# EAGLE design UARTBreakout-3.0 (EAGLE 9.6.2)
Assembly variants: JLCPCB

## Sheet 1 of 2
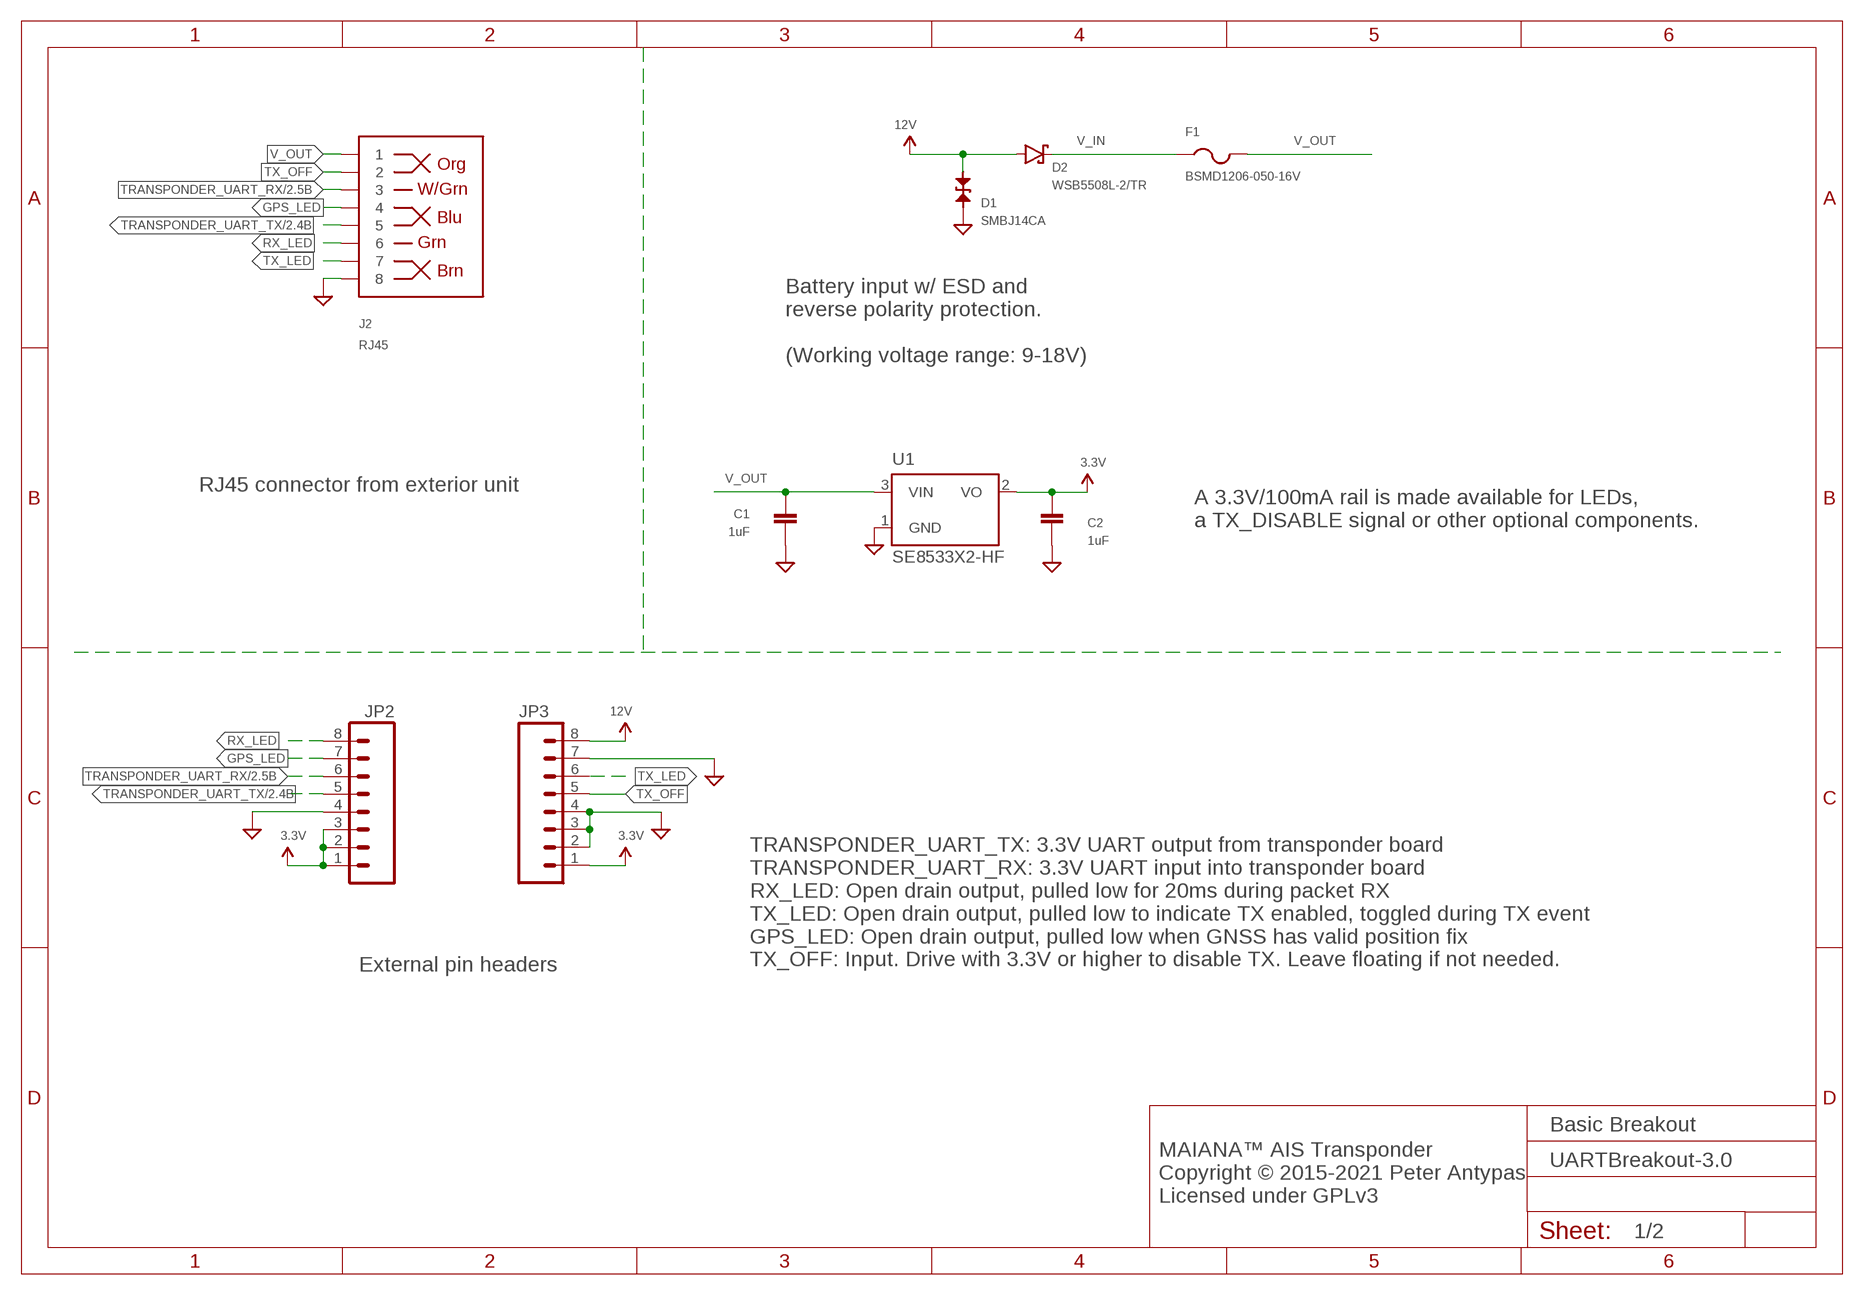
[diagram p0: schematic, sheet 1]

### Parts
C1  1uF  CAPACITOR0603  [0603]
C2  1uF  CAPACITOR0603  [0603]
D1  SMBJ14CA  DIODE-TVS-BIDIRSMB  [SMB-BIDIR]
D2  WSB5508L-2/TR  DIODE-SCHOTTKYSOD123  [SOD123]
F1  BSMD1206-050-16V  PTCFUSE-1206  [R1206]
J2  RJ45  RJ45-8PTH  [RJ45-8]
JP2  M08SILK_FEMALE_PTH  [1X08]
JP3  M08SILK_FEMALE_PTH  [1X08]
U1  SE8533X2-HF  MCP1799T  [SOT23]

### Nets
3.3V: C2.P$1 JP2.1 JP2.2 JP2.3 JP3.1 U1.2(VO)
12V: D1.A D2.A JP3.8
GND: C1.P$2 C2.P$2 D1.C J2.8 JP2.4 JP3.2 JP3.3 JP3.4 JP3.7 U1.1(GND) ; also sheet 2
GPS_LED: J2.4 JP2.7
RX_LED: J2.6 JP2.8
TRANSPONDER_UART_RX: J2.3 JP2.6 ; also sheet 2
TRANSPONDER_UART_TX: J2.5 JP2.5 ; also sheet 2
TX_LED: J2.7 JP3.6
TX_OFF: J2.2 JP3.5
V_IN: D2.C F1.1
V_OUT: C1.P$1 F1.2 J2.1 U1.3(VIN)

### Notes on the sheet
- Battery input w/ ESD and 
  reverse polarity protection.
  
  (Working voltage range: 9-18V)
- RJ45 connector from exterior unit
- A 3.3V/100mA rail is made available for LEDs,
  a TX_DISABLE signal or other optional components.
- External pin headers
- TRANSPONDER_UART_TX: 3.3V UART output from transponder board
  TRANSPONDER_UART_RX: 3.3V UART input into transponder board
  RX_LED: Open drain output, pulled low for 20ms during packet RX
  TX_LED: Open drain output, pulled low to indicate TX enabled, toggled during TX event
  GPS_LED: Open drain output, pulled low when GNSS has valid position fix
  TX_OFF: Input. Drive with 3.3V or higher to disable TX. Leave floating if not needed.
- Basic Breakout
- MAIANA™ AIS Transponder
  Copyright © 2015-2021 Peter Antypas
  Licensed under GPLv3

## Sheet 2 of 2
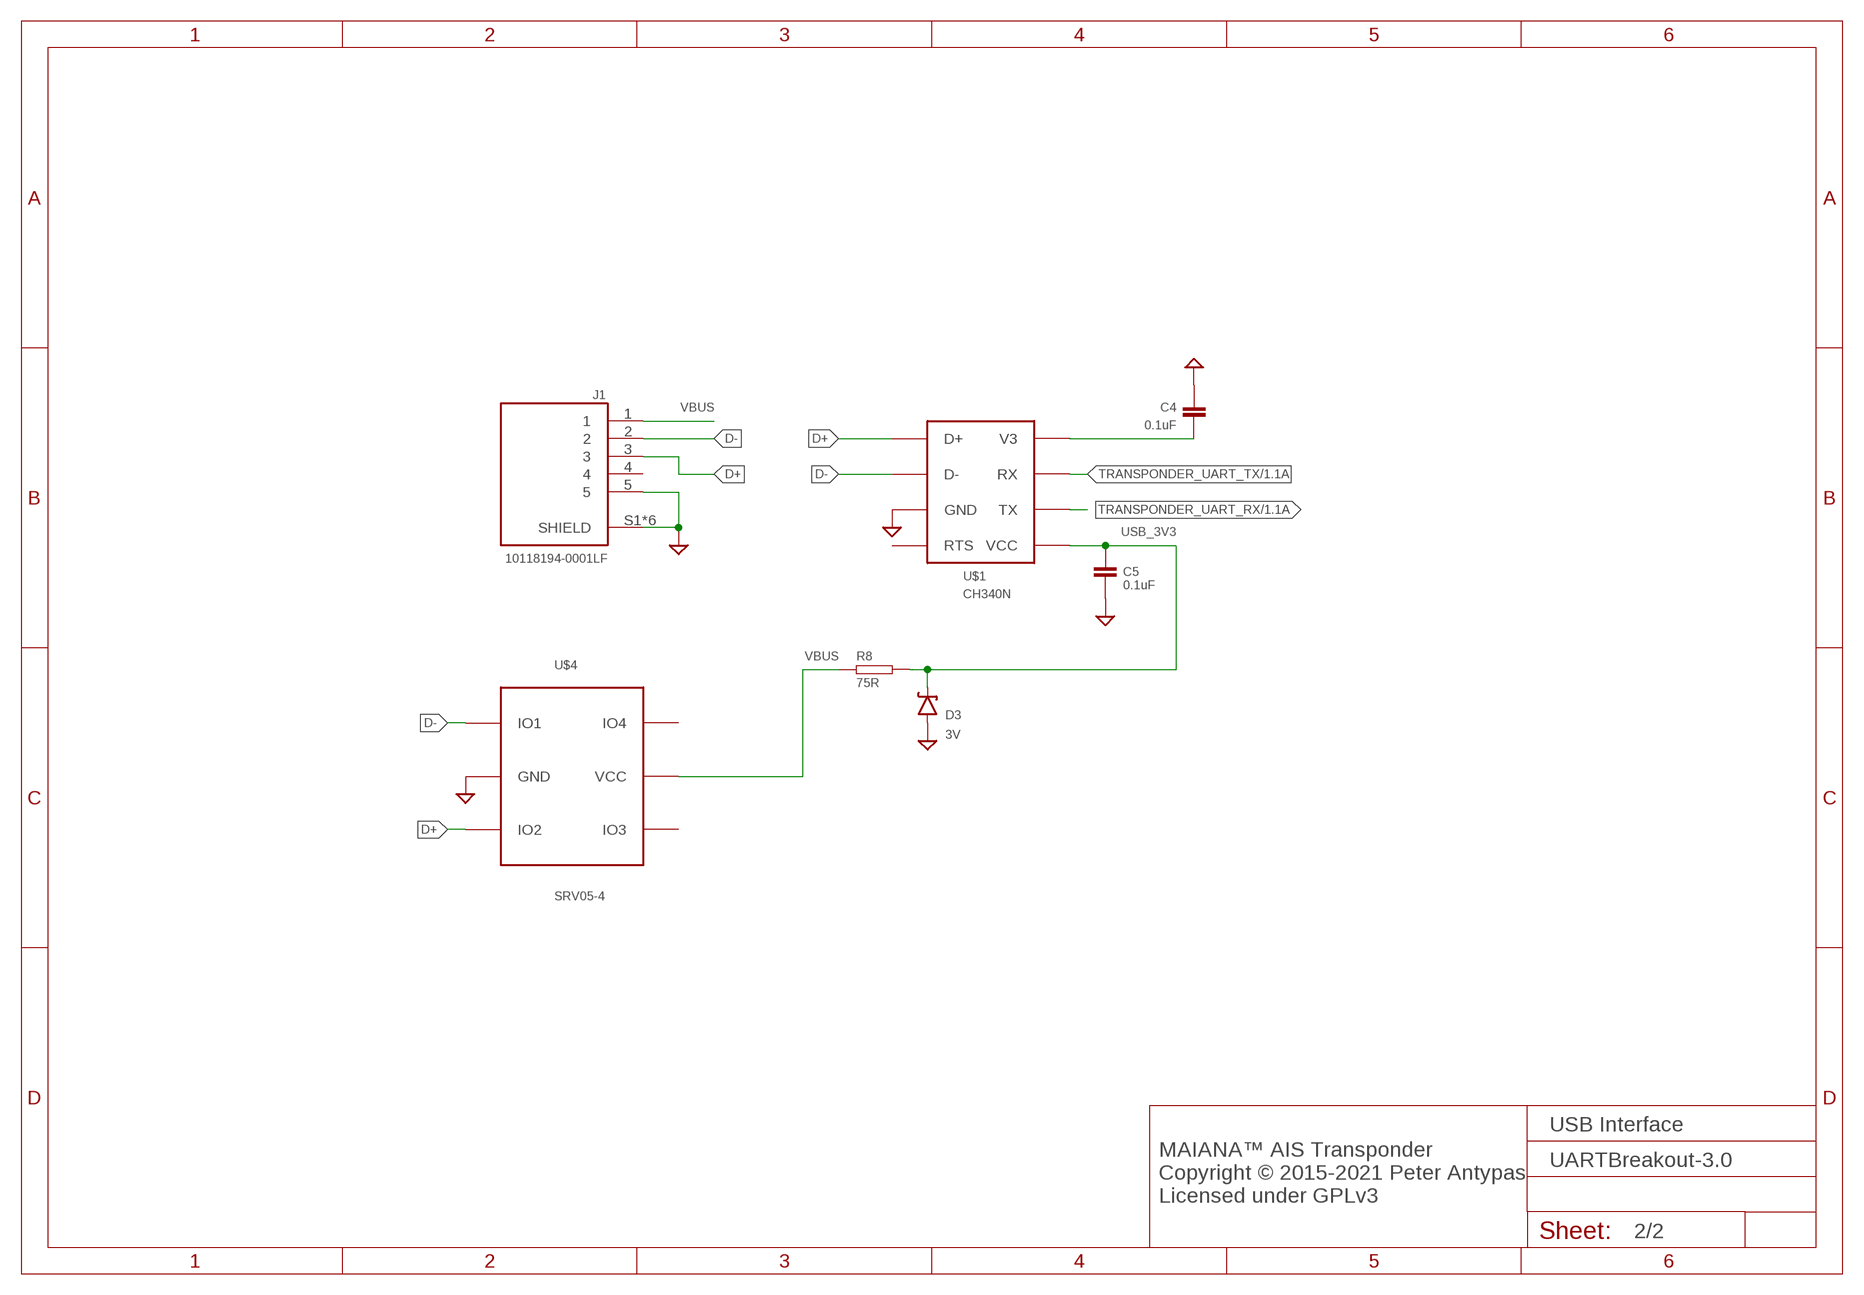
[diagram p1: schematic, sheet 2]

### Parts
C4  0.1uF  CAPACITOR0603  [0603]
C5  0.1uF  CAPACITOR0603  [0603]
D3  3V  DIODE-ZENER3.3V  [SOD-323]
J1  10118194-0001LF  [AMPHENOL_10118194-0001LF]
R8  75R  RESISTOR0603  [0603]
U$1  CH340N  CH330N  [SOIC-8]
U$4  SRV05-4  [SOT23-6]

### Nets
D+: J1.3 U$1.1(D+) U$4.3(IO2)
D-: J1.2 U$1.2(D-) U$4.1(IO1)
GND: C4.P$2 C5.P$2 D3.A J1.5 J1.S1(SHIELD) J1.S2(SHIELD) J1.S3(SHIELD) J1.S4(SHIELD) J1.S5(SHIELD) J1.S6(SHIELD) U$1.3(GND) U$4.2(GND) ; also sheet 1
N$3: C4.P$1 U$1.8(V3)
TRANSPONDER_UART_RX: U$1.6(TX) ; also sheet 1
TRANSPONDER_UART_TX: U$1.7(RX) ; also sheet 1
USB_3V3: C5.P$1 D3.C R8.P$2 U$1.5(VCC)
VBUS: J1.1 R8.P$1 U$4.5(VCC)
Unconnected: J1.4 U$1.4(RTS) U$4.4(IO3) U$4.6(IO4)

### Notes on the sheet
- USB Interface
- MAIANA™ AIS Transponder
  Copyright © 2015-2021 Peter Antypas
  Licensed under GPLv3

## Library data of the parts
C1 C2 = MyPassives:CAPACITOR: Standard SMD capacitor; PARTNO: CC0603KRX5R8BB105
C4 C5 = MyPassives:CAPACITOR: Standard SMD capacitor
D1 = MyDiodes:DIODE-TVS-BIDIR: Bidirectional TVS diode; PARTNO: SMBJ14CA
D2 = MyDiodes:DIODE-SCHOTTKY: Standard SMD Schottky diode; PARTNO: WSB5508L-2/TR
D3 = SparkFun-DiscreteSemi:DIODE-ZENER: Zener Diode Production Part - 8199 3.4V Zener Voltage; PROD_ID: DIO-11284; VALUE: 3.3V
F1 = adafruit:PTCFUSE: PTC fuses, resettable thermistors; PARTNO: BSMD1206-050-16V
J1 = 10118194-0001LF:10118194-0001LF: Micro Usb, 2.0 Type b, Rcpt, Smt Check prices <https://snapeda.com/parts/10118194-0001LF/Amphenol%20ICC%20%28FCI%29/view-part/?ref=eda>; ARROW_ELECTRONICS-PURCHASE-URL: https://snapeda.com/shop?store=Arrow+Electronics&id=4816633; AVAILABILITY: Good; DESCRIPTION: USB - micro B USB 2.0 Receptacle Connector 5 Position Surface Mount, Right Angle; Through Hole; DIGIKEY-PURCHASE-URL: https://snapeda.com/shop?store=DigiKey&id=4816633; MF: Amphenol ICC (FCI); MOUSER-PURCHASE-URL: https://snapeda.com/shop?store=Mouser&id=4816633; MP: 10118194-0001LF; PACKAGE: None; PRICE: None
J2 = SparkFun-Connectors:RJ45-8: RJ45 Jack Simple RJ45, 8-pin connection - connector for common Cat5, Cat5e, and Cat6 Ethernet cables. Footprint not yet proven in production. Connector sku is PRT-00643; Breakout PCB sku is BOB-00716.; PARTNO: 95501-2821; PROD_ID: CONN-08506
JP2 JP3 = SparkFun-Connectors:M08: Header 8 Standard 8-pin 0.1" header. Use with straight break away headers (SKU : PRT-00116), right angle break away headers (PRT-00553), swiss pins (PRT-00743), machine pins (PRT-00117), and female headers (PRT-00115).; PROD_ID: CONN-08438
R8 = MyPassives:RESISTOR: Standard SMD resistor
U1 = microchip:MCP1799T: 80mA High Voltage Automotive LDO; PARTNO: SE8533X2-HF; VALUE: MCP1799T
U$1 = JiangsuQinHeng:CH330N: USB to UART bridge; PARTNO: CH340N
U$4 = yenji:SRV05-4: Low Capacitance TVS Diode Array

## Board
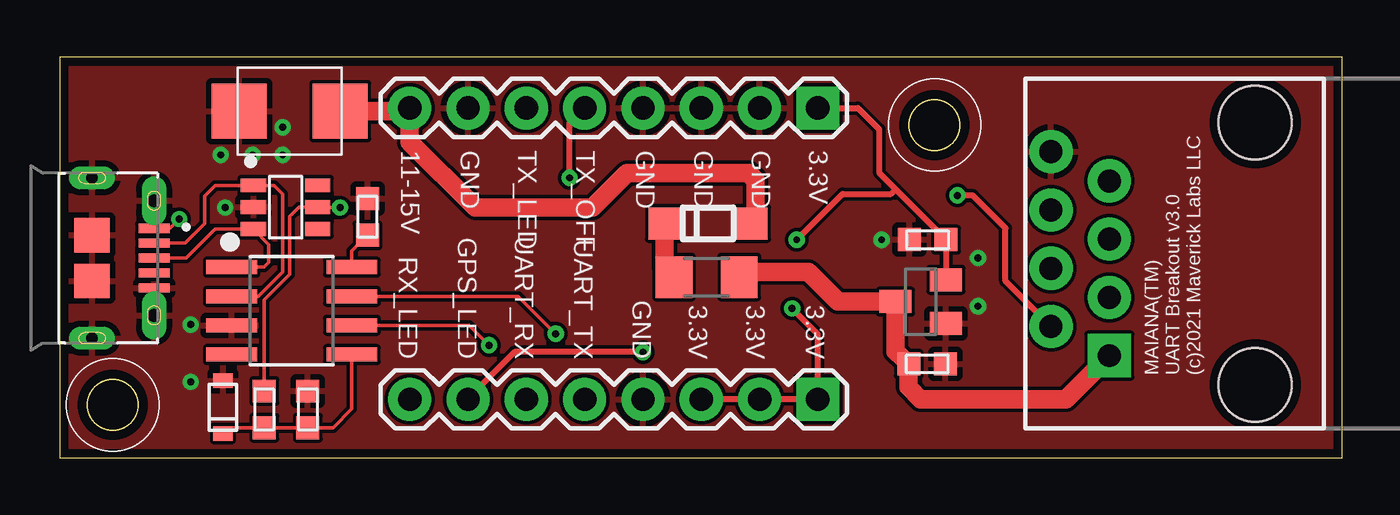
[diagram p2: board, top side]
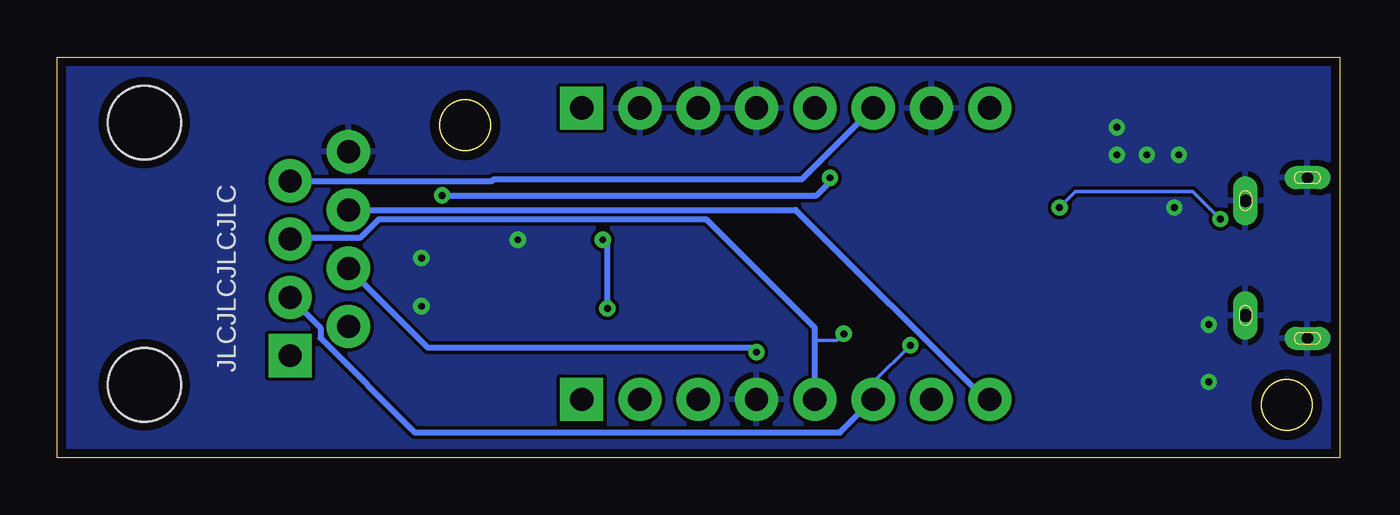
[diagram p3: board, bottom side, seen from below]

Size 55.86 x 17.45 mm. Coordinates in mm from the lower left corner, seen from the top.
Outline: 0,0 55.86,0 55.86,17.45 0,17.45 0,0
Outline: circle at 38.1,14.5 radius 1.1
Outline: circle at 2.3,2.3 radius 1.1
Copper layers (1*16): Top 0.035mm / dielectric 1.5mm / Bottom 0.035mm
Design rules "default *": minimum track width 6mil, minimum drill 0.3mm, track to track 6mil, track to pad 6mil, pad to pad 6mil, via to via 6mil, smd to smd 0mil, copper to edge 15mil, drill to drill 6mil, minimum pad ring 10mil, minimum via ring 8mil, stop-mask expansion 4mil, vias tented up to drill 20mil, thermal gap 10mil

### Footprints (pad centres in the part's own frame; a part is rotated, then mirrored left to right if it is on the bottom)
0603 = smd 1 x 1: P$1 -0.8,0; P$2 0.8,0
SMB-BIDIR = smd 2.4 x 2.4: A 2.2,0; C -2.2,0
SOD123 = smd 1.4 x 1.4: A 1.9,0; C -1.9,0
SOD-323 = smd 0.63 x 0.83: A 1.15,0; C -1.15,0
R1206 = smd 1.6 x 1.803: 1 -1.422,0; 2 1.422,0
AMPHENOL_10118194-0001LF = smd 0.4 x 1.35: 1 -1.3,2.7; 2 -0.65,2.7; 3 0,2.7; 4 0.65,2.7; 5 1.3,2.7 | drill 0.55 pad 0.65 long: S1 -2.5,2.7; S2 2.5,2.7 | drill 0.5 pad 0.775 long: S3 -3.5,0; S6 3.5,0 | smd 1.5 x 1.55: S4 -1,0; S5 1,0
RJ45-8 = drill 1 pad 1.88 square: 1 -4.445,6.35 | drill 1 pad 1.88: 2 -3.175,8.89; 3 -1.905,6.35; 4 -0.635,8.89; 5 0.635,6.35; 6 1.905,8.89; 7 3.175,6.35; 8 4.445,8.89 | hole 3.2: -5.715,0; 5.715,0
1X08 = drill 1.016 pad 1.88 square: 1 0,0 | drill 1.016 pad 1.88: 2 2.54,0; 3 5.08,0; 4 7.62,0; 5 10.16,0; 6 12.7,0; 7 15.24,0; 8 17.78,0
SOT23 = smd 1 x 1.4: 1 -0.95,-1.1; 2 0.95,-1.1; 3 0,1.1
SOIC-8 = smd 2.21 x 0.61: 1 -2.616,1.905; 2 -2.616,0.635; 3 -2.616,-0.635; 4 -2.616,-1.905; 5 2.616,-1.905; 6 2.616,-0.635; 7 2.616,0.635; 8 2.616,1.905
SOT23-6 = smd 1.1 x 0.6: 1 -1.37,0.97; 2 -1.37,0.02; 3 -1.37,-0.93; 4 1.43,-0.93; 5 1.43,0.02; 6 1.43,0.97

### Placement (x,y rotation side)
C1  37.78,4.08 0 top
C2  37.8,9.5 180 top
C4  13.4,10.5 90 top
C5  10.8,2.1 90 top
D1  10.01,15.11 0 top
D2  28.23,10.21 0 top
D3  7.1,2.2 90 top
F1  28.17,7.87 0 top
J1  1.4,8.7 270 top
J2  52.07,8.89 90 top
JP2  33.02,2.54 180 top
JP3  33.02,15.24 180 top
R8  8.9,2.1 270 top
U1  37.5,6.8 90 top
U$1  10.1,6.4 0 top
U$4  9.8,10.9 0 top

### Tracks (layer width: path | path; a pad name or v marks a point on that pad's centre or on a via)
3.3V  (via drill 0.3)
  Top 0.254: JP3.1 34.76,15.24 35.69,14.31 35.69,12.43 36.41,11.71 | JP2.3 JP2.2 JP2.1 33.02,5.38 v31.9,6.5 | 36.41,11.71 C2.P$1 38.6,9.53 U1.2 | v32.1,9.5 34.1,11.5 36.2,11.5 36.41,11.71
  Bottom 0.254: v31.9,6.5 31.9,9.3 v32.1,9.5
12V
  Top 0.813: D2.A 30.3,10.38 30.3,12.1 30,12.4 24.7,12.4 23.2,10.9 18.1,10.9 15.24,13.76 JP3.8 15.11,15.11 D1.A
D+
  Top 0.152: J1.3 5.5,8.7 6.77,9.97 U$4.3 9.1,9.3 9.1,8.5 8.9,8.3 U$1.1
D-
  Top 0.152: J1.2 5.45,9.35 6.3,10.2 6.3,11.4 6.77,11.87 U$4.1 9.33,11.87 9.7,11.5 9.7,8.1 8.63,7.04 U$1.2
GND  (via drill 0.3)
  other vias: 40,8.7 40,6.6 35.8,9.5 7,13.2 8.4,13.2 9.7,13.2 9.7,14.4 7.2,10.9 5.7,3.3 5.7,5.8
  pour Top: -1.27,19.05 56.71,19.05 56.71,-1.27 -1.27,-1.27
  pour Bottom: -2.54,20.32 57.48,20.32 57.48,-3.81 -2.54,-3.81
GPS_LED  (via drill 0.3)
  Top 0.254: v25.4,4.6 19.8,4.6 17.78,2.58 JP2.7
  Bottom 0.254: J2.4 39.73,4.8 25.6,4.8 v25.4,4.6
N$3
  Top 0.152: C4.P$1 12.72,9.02 U$1.8
RX_LED
  Bottom 0.254: J2.6 23.7,10.79 15.44,2.54 JP2.8
TRANSPONDER_UART_RX  (via drill 0.3)
  Top 0.152: U$1.6 17.84,5.76 v18.7,4.9
  Bottom 0.152: v18.7,4.9 20.32,3.28 JP2.6
  Bottom 0.254: J2.3 44.4,5.66 44.4,5.21 40.29,1.1 21.76,1.1 JP2.6
TRANSPONDER_UART_TX  (via drill 0.3)
  Top 0.152: U$1.7 19.96,7.04 v21.6,5.4
  Bottom 0.152: v21.6,5.4 21.9,5.1 22.86,5.1
  Bottom 0.254: JP2.5 22.86,5.1 22.86,5.66 27.59,10.39 41.86,10.39 42.67,9.58 45.67,9.58 J2.5
TX_LED
  Bottom 0.254: J2.7 36.91,12.06 36.85,12.13 23.43,12.13 JP3.6
TX_OFF  (via drill 0.3)
  Top 0.254: J2.2 41.2,7.7 41.2,10 39.77,11.43 v39.1,11.43 | v22.2,12.2 22.2,14.58 JP3.5
  Bottom 0.254: v39.1,11.43 22.79,11.43 22.2,12.02 v22.2,12.2
USB_3V3
  Top 0.152: D3.C 7.35,1.3 R8.P$2 C5.P$1 11.9,1.3 12.72,2.12 U$1.5
V_IN
  Top 0.813: D2.C 26.34,8.28 F1.1
V_OUT
  Top 0.813: F1.2 29.59,8.1 32.6,8.1 33.9,6.8 U1.3 36.4,4.64 C1.P$1 36.95,3.08 37.48,2.54 43.82,2.54 J2.1
VBUS  (via drill 0.3)
  Top 0.152: J1.1 4.8,10 v5.2,10.4 | v12.2,10.9 11.25,10.9 U$4.5 10.42,10.92 10.01,10.51 10.01,7.97 8.9,6.87 R8.P$1
  Bottom 0.152: v5.2,10.4 6.4,11.6 11.5,11.6 v12.2,10.9

### Text on the board
tNames: 11-15V | GND | TX_LED | TX_OFF | GND | GND | GND | 3.3V | RX_LED | GPS_LED | UART_RX | UART_TX | GND | 3.3V | 3.3V | 3.3V | MAIANA(TM) / UART Breakout v3.0 / (c)2021 Maverick Labs LLC
bNames: JLCJLCJLCJLC